# EAGLE design switch (EAGLE 7.6.0)

## Sheet 1 of 2
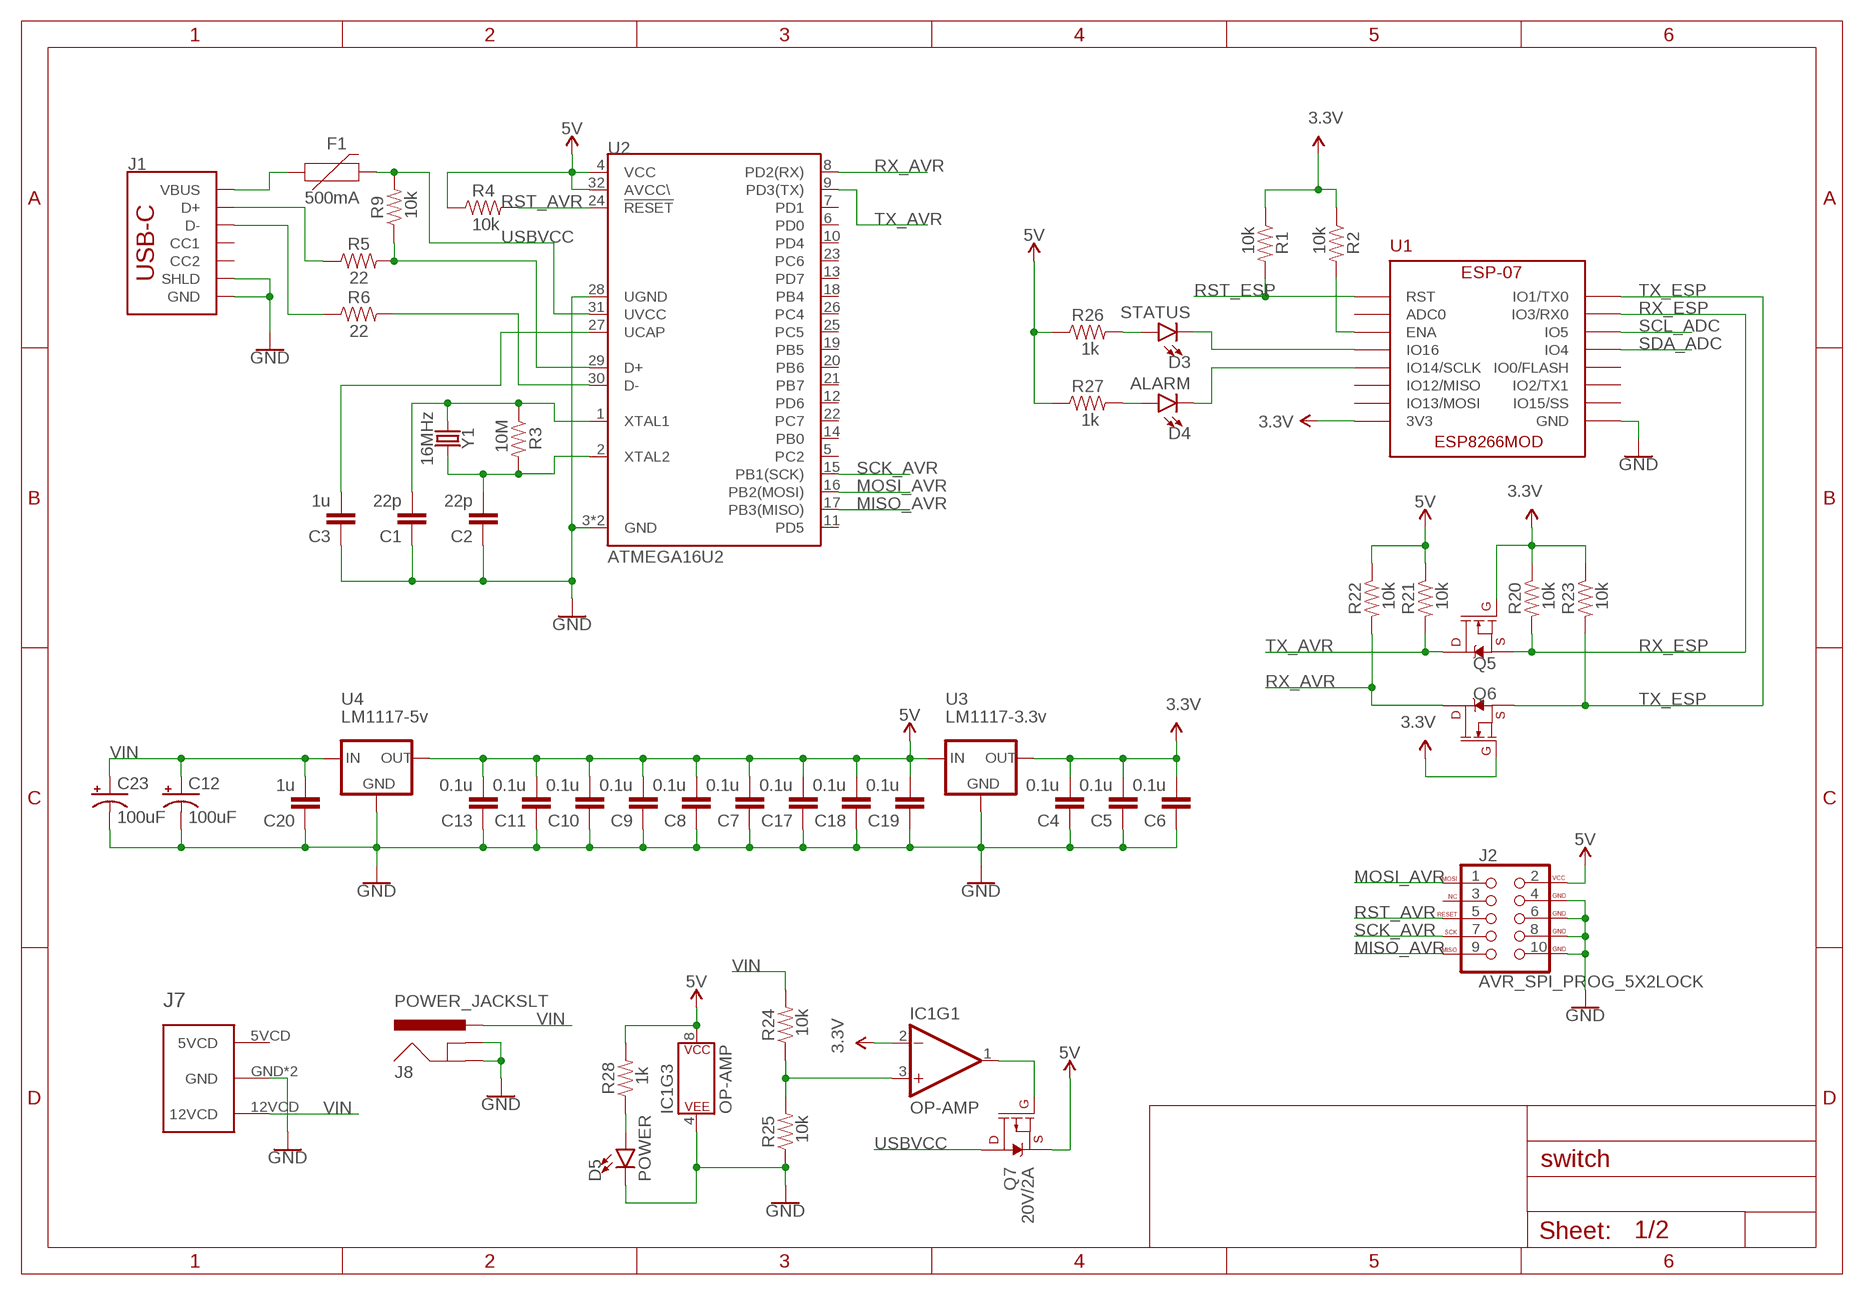
[diagram p0: schematic, sheet 1]

### Parts
C1  22p  CAP-0805  [0805]
C2  22p  CAP-0805  [0805]
C3  1u  CAP-0805  [0805]
C4  0.1u  CAP-0805  [0805]
C5  0.1u  CAP-0805  [0805]
C6  0.1u  CAP-0805  [0805]
C7  0.1u  CAP-0805  [0805]
C8  0.1u  CAP-0805  [0805]
C9  0.1u  CAP-0805  [0805]
C10  0.1u  CAP-0805  [0805]
C11  0.1u  CAP-0805  [0805]
C12  100uF  100UF-POLAR-25V-20%(ELEC)  [PANASONIC_D]
C13  0.1u  CAP-0805  [0805]
C17  0.1u  CAP-0805  [0805]
C18  0.1u  CAP-0805  [0805]
C19  0.1u  CAP-0805  [0805]
C20  1u  CAP-0805  [0805]
C23  100uF  100UF-POLAR-25V-20%(ELEC)  [PANASONIC_D]
D3  STATUS  LED-YELLOW0603  [LED-0603]
D4  ALARM  LED-YELLOW0603  [LED-0603]
D5  POWER  LED-YELLOW0603  [LED-0603]
F1  500mA  PPTC_16V_2.5A  [1812]
IC1  OP-AMP  OPAMP-DUALU  [SO08]
J1  USB_C_2-LAYER_PADS  [USB-C-16P-2LAYER-PADS]
J2  AVR_SPI_PROG_5X2LOCK  [2X5-SHROUDED_LOCK]
J7  MOLEX-CPU-POWER  [MOLEX-5.08-4PIN]
J8  POWER_JACKSLT  [POWER_JACK_SLOT]
Q5  220mA/50V/3.5Ω  MOSFET-NCH-BSS138  [SOT23-3]
Q6  220mA/50V/3.5Ω  MOSFET-NCH-BSS138  [SOT23-3]
Q7  20V/2A  MOSFET_PCH-DMG2305UX-7  [SOT23-3]
R1  10k  RESISTOR0805  [0805]
R2  10k  RESISTOR0805  [0805]
R3  10M  RESISTOR0805  [0805]
R4  10k  RESISTOR0805  [0805]
R5  22  RESISTOR0805  [0805]
R6  22  RESISTOR0805  [0805]
R9  10k  RESISTOR0805  [0805]
R20  10k  RESISTOR0805  [0805]
R21  10k  RESISTOR0805  [0805]
R22  10k  RESISTOR0805  [0805]
R23  10k  RESISTOR0805  [0805]
R24  10k  RESISTOR0805  [0805]
R25  10k  RESISTOR0805  [0805]
R26  1k  RESISTOR0805  [0805]
R27  1k  RESISTOR0805  [0805]
R28  1k  RESISTOR0805  [0805]
U1  ESP-07  [ESP-07]
U2  ATMEGA16U2  [QFN32]
U3  LM1117-3.3v  V_REG_LD1117VXXLD1117-SMD  [SOT223]
U4  LM1117-5v  V_REG_LD1117VXXLD1117-SMD  [SOT223]
Y1  16MHz  CRYSTAL-16MHZSMD-5X3.2  [CRYSTAL-SMD-5X3.2-4PAD]

### Nets
3.3V: C4.2 C5.2 C6.2 IC1.2(-IN) Q5.1(G) Q6.1(G) R1.1 R2.1 R20.1 R23.1 U1.3V3 U3.2(OUT)
5V: C7.2 C8.2 C9.2 C10.2 C11.2 C13.2 C17.2 C18.2 C19.2 IC1.8(P$V+) J2.2(VCC) Q7.2(S) R4.1 R21.1 R22.1 R26.1 R27.1 R28.2 U2.4(VCC) U2.32(AVCC\) U3.3(IN) U4.2(OUT)
GND: C1.1 C2.1 C3.1 C4.1 C5.1 C6.1 C7.1 C8.1 C9.1 C10.1 C11.1 C12.- C13.1 C17.1 C18.1 C19.1 C20.1 C23.- D5.C IC1.4(P$V-) J1.GND J1.GND2(GND) J1.SHLD1(SHLD) J1.SHLD2(SHLD) J1.SHLD3(SHLD) J1.SHLD4(SHLD) J2.4(GND) J2.6(GND) J2.8(GND) J2.10(GND) J7.GND J7.GND2(GND) J8.GND@1(GNDBREAK) J8.GND@2(GND) R25.1 U1.GND U2.3(GND) U2.28(UGND) U2.EP(GND) U3.1(GND) U4.1(GND)
MISO_AVR: J2.9(MISO) U2.17(PB3(MISO))
MOSI_AVR: J2.1(MOSI) U2.16(PB2(MOSI))
N$1: C1.2 R3.1 U2.1(XTAL1) Y1.1
N$2: C2.2 R3.2 U2.2(XTAL2) Y1.3
N$3: C3.2 U2.27(UCAP)
N$6: R6.2 U2.30(D-)
N$7: R5.2 R9.1 U2.29(D+)
N$8: J1.A6(D+) J1.B6(D+) R5.1
N$9: J1.A7(D-) J1.B7(D-) R6.1
N$10: F1.1 J1.VBUS1(VBUS) J1.VBUS2(VBUS)
N$14: R2.2 U1.ENA
N$28: IC1.1(OUT) Q7.1(G)
N$29: IC1.3(+IN) R24.1 R25.2
N$30: D3.C U1.I016(IO16)
N$31: D4.C U1.IO14(IO14/SCLK)
N$32: D3.A R26.2
N$33: D4.A R27.2
N$36: D5.A R28.1
RST_AVR: J2.5(RESET) R4.2 U2.24(!RESET)
RST_ESP: R1.2 U1.RST
RX_AVR: Q6.3(D) R22.2 U2.8(PD2(RX))
RX_ESP: Q5.2(S) R20.2 U1.RX0(IO3/RX0)
SCK_AVR: J2.7(SCK) U2.15(PB1(SCK))
SCL_ADC: U1.IO5
SDA_ADC: U1.IO4
TX_AVR: Q5.3(D) R21.2 U2.9(PD3(TX))
TX_ESP: Q6.2(S) R23.2 U1.TX0(IO1/TX0)
USBVCC: F1.2 Q7.3(D) R9.2 U2.31(UVCC)
VIN: C12.+ C20.2 C23.+ J7.12VCD J8.PWR R24.2 U4.3(IN)
Unconnected: IC1.5(+IN) IC1.6(-IN) IC1.7(OUT) J1.A5(CC1) J1.B5(CC2) J2.3(NC) J7.5VCD U1.ADC(ADC0) U1.IO0(IO0/FLASH) U1.IO2(IO2/TX1) U1.IO12(IO12/MISO) U1.IO13(IO13/MOSI) U1.IO15(IO15/SS) U2.5(PC2) U2.6(PD0) U2.7(PD1) U2.10(PD4) U2.11(PD5) U2.12(PD6) U2.13(PD7) U2.14(PB0) U2.18(PB4) U2.19(PB5) U2.20(PB6) U2.21(PB7) U2.22(PC7) U2.23(PC6) U2.25(PC5) U2.26(PC4)

## Sheet 2 of 2
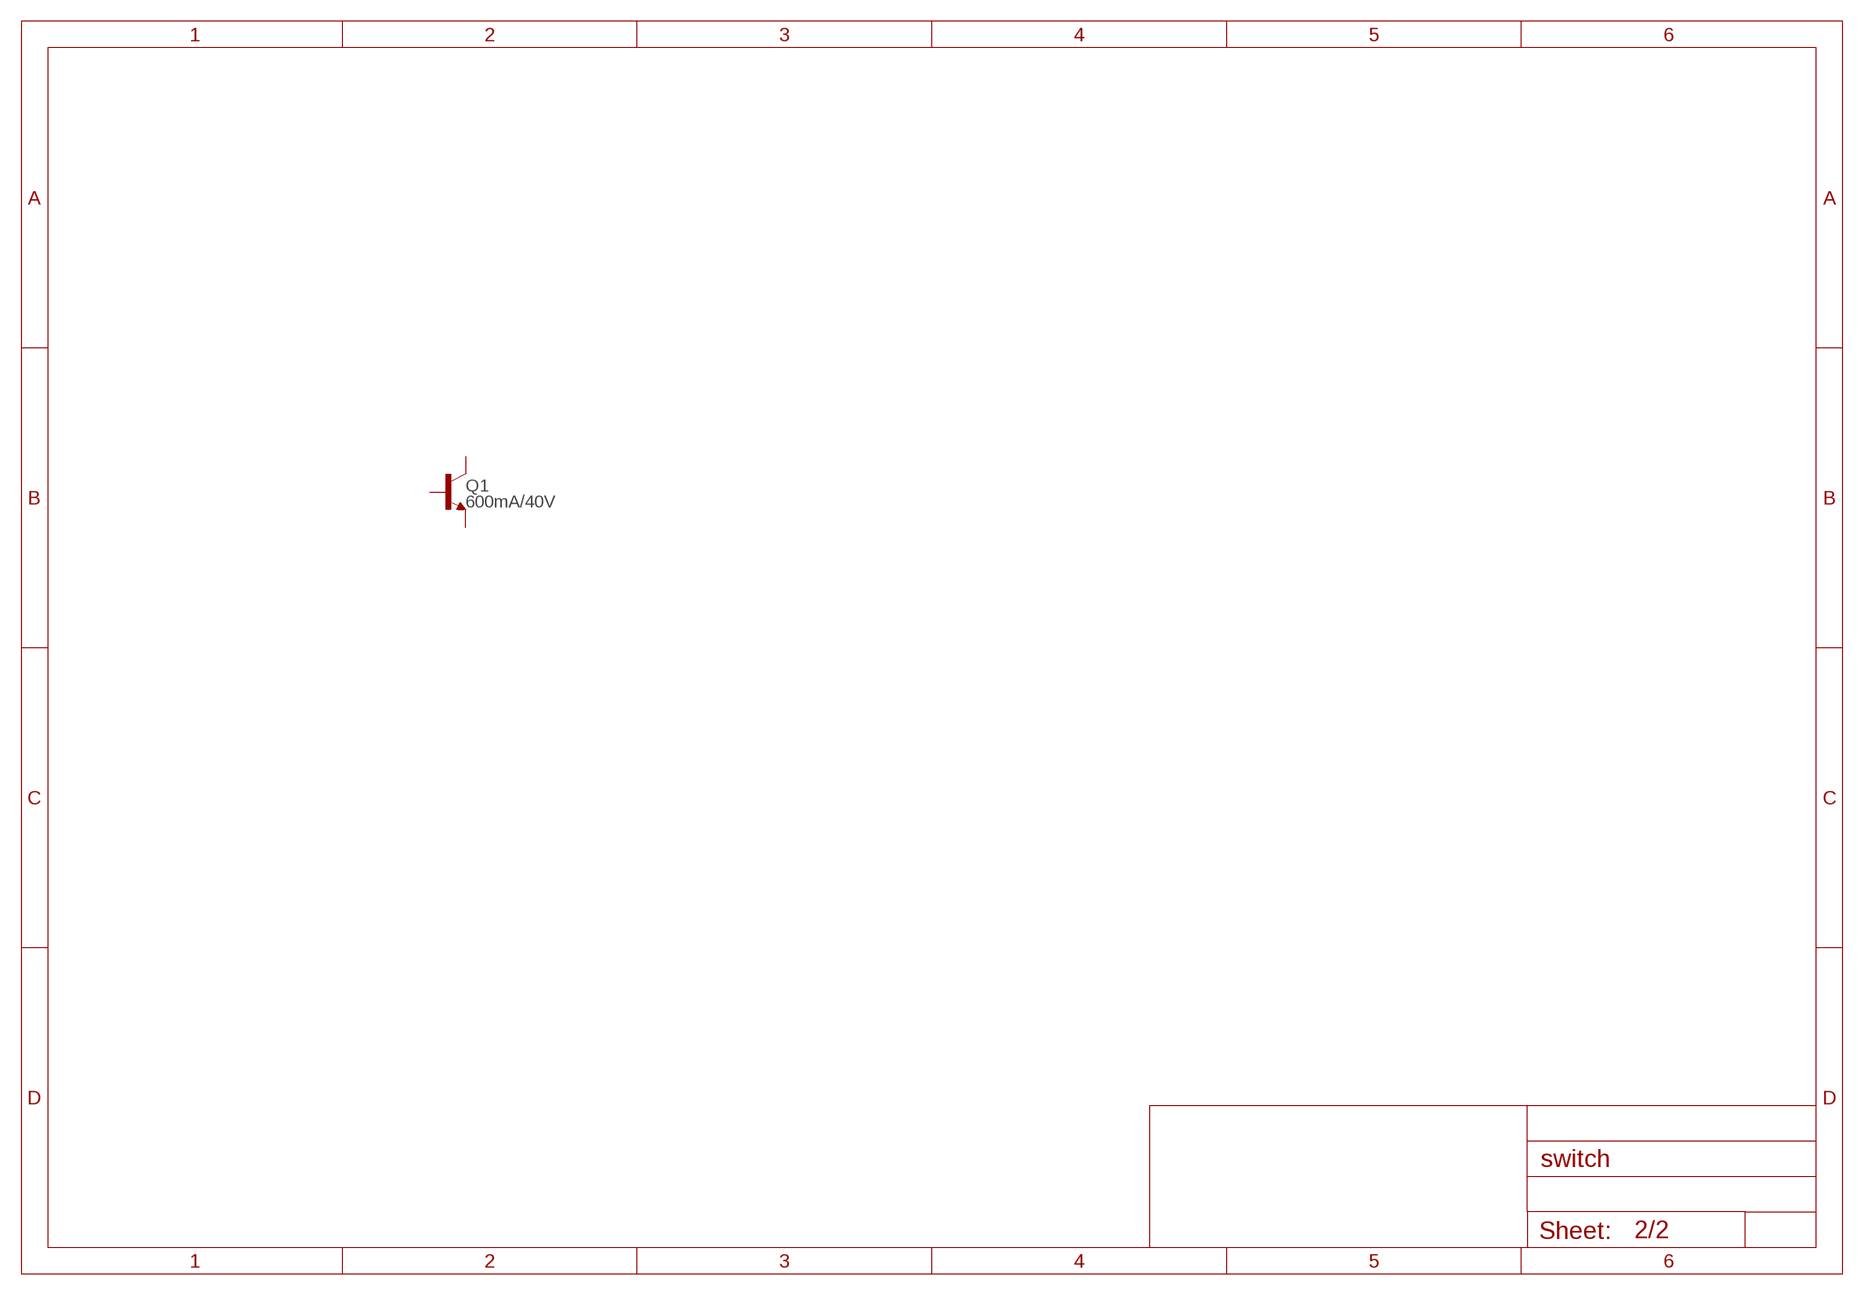
[diagram p1: schematic, sheet 2]

### Parts
Q1  600mA/40V  TRANS_NPN-MMBT2222AL  [SOT23-3]
Unconnected: Q1.1(B) Q1.2(E) Q1.3(C)

## Library data of the parts
C1-C11 C13 C17-C20 = SparkFun-Capacitors:CAP
C12 C23 = SparkFun-Capacitors:100UF-POLAR: 100µF polarized capacitors A capacitor is a passive two-terminal electrical component used to store electrical energy temporarily in an electric field.; PROD_ID: CAP-12547
D3-D5 = SparkFun-LED:LED-YELLOW: Yellow SMD LED Used in manufacturing several products at SparkFun. Packages: 0603 - SMD 0603 package[Product Link] <http://www.kingbrightusa.com/product.asp?catalog_name=LED&product_id=APT1608SYCK> 0603 -SMART - SMART SMD 0603 package (more efficient/more expensive) [Product Link] <http://www.osram-os.com/osram_os/en/products/product-catalog/led-light-emitting-diodes/smartled-0603/ly-l29k/index.jsp> LilyPad - SMD1206 package[Product Datasheet] <https://www.sparkfun.com/datasheets/DevTools/LilyPad/Q150YUS4.pdf> SparkFun Products: Blynk Board <https://www.sparkfun.com/products/13794> IOIO-OTG <https://www.sparkfun.com/products/13613> XBee Explorer Serial <https://www.sparkfun.com/products/13225>; PROD_ID: DIO-09003; VALUE: Yellow
F1 = SparkFun-Fuses:PPTC: Resettable Fuse PPTC Resettable Fuse. Really a sort of resistor with a polymeric positive temperature coefficient whose resistance increases dramatically with an increase in temperature. When heated by the power passing through the resistance rises causing the current to be limited, protecting the circuit. This is achieved by the transition of the polymer from a crystalline to an amorphous state where the conductive carbon separates breaking the conductive pathways found in the cool crystalline structure. When a PPTC cools back down it resumes conducting letting the circuit turn back on. SparkFun Products: SparkFun RedBoard - Programmed with Arduino <https://www.sparkfun.com/products/12757> Pro Micro - 5V/16MHz <https://www.sparkfun.com/products/12640> Arduino Pro 328 - 5V/16MHz <https://www.sparkfun.com/products/10915> MP3 Trigger <https://www.sparkfun.com/products/13720>; PROD_ID: RES-14390; VALUE: 16V/2.5A(5A TRIP)
IC1 = SparkFun-IC-Amplifiers:OPAMP-DUAL: Generic op-amp footprint This component is for the standard 358 pinning of a dual op-amp From the LM358 datasheet: Pin 1: Output A Pin 2: Inverting Input A Pin 3: Non-Inverting Input A Pin 4: Gnd Pin 5: Non-Inverting Input B Pin 6: Inverting Input B Pin 7: Output B Pin 8: V+; PROD_ID: NA-XXXXX
J1 = SparkFun-Connectors:USB_C: USB Type C 16Pin Connector Super Speed pins not available on the 16-pin purely SMD connector so this part is best for USB 2.0 implementations. D1 and D2 are tied together enabling D+/- no matter which way the cable is plugged into the connector. The two channel configuration pins (CC1/2) are exposed. These are normally connected to ground via 5.1k resistors but can be reconfigured for high current/high power applications. **4-LAYER BOARD WARNING!!** If designing 4-layer board, make sure to select the variant _4-LAYER-ISOLATED. The linked footprint (USB-C-16-4LAYER-ISOLATED) includes some very necessary cutout polygons in the inner layers (2 and 15). This prevents the PTH mounting shield legs on the USB connector from electrically connecting any other polygons on the inner layers (usually VCC and GND).; PROD_ID: CONN-14122
J2 = SparkFun-Connectors:AVR_SPI_PROG_5X2: AVR 10-pin ICSP Header This is the standard AVR In Circuit Serial Programming header. Minimal, but includes pin one indicator. Works with standard Olimex programmers. SparkFun Products: 2x5 AVR ICSP Male Header <https://www.sparkfun.com/products/778> - PTH 2x5 Pin Shrouded Header <https://www.sparkfun.com/products/8506> - PTH2; PROD_ID: CONN-08671; SF_ID: PRT-08506
J7 = Cominer-Connectors:MOLEX-CPU-POWER
J8 = SparkFun-Connectors:POWER_JACK: Power Jack Connector This is the standard 5.5mm barrel jack for power. The PTH is the most common, proven, reliable, footprint. The Slot footprint only works if the mill layer is transmitted to the PCB fab house so be warned. Here are the connectors we sell at SparkFun: DC Barrel Power Jack/Connector <https://www.sparkfun.com/products/119> (PRT-00119) DC Barrel Power Jack/Connector (SMD) <https://www.sparkfun.com/products/12748> (PRT-12748) DC Barrel Jack Adapter - Breadboard Compatible <https://www.sparkfun.com/products/10811> (PRT-10811) It is used on this SparkFun product (and many, many others): SparkFun RedBoard - Programmed with Arduino <https://www.sparkfun.com/products/12757> (DEV-12757) Also, if you need a mating power supply or connector, please check these out: Wall Adapter Power Supply - 9VDC 650mA <https://www.sparkfun.com/products/298> (TOL-00298) DC Barrel Jack Adapter - Male <https://www.sparkfun.com/products/10287> (PRT-10287); PROD_ID: PRT-00119
Q1 = SparkFun-DiscreteSemi:TRANS_NPN: NPN transistor Current controlled devices typically used to amplify current or used as a switch. BC547 - COM-08928 <http://www.sparkfun.com/products/8928> (TO-92 45V 100mA) (1.Collector 2.Base 3.Emitter) 2N3904 - COM-00521 <http://www.sparkfun.com/products/521> (TO-92 40V 200mA) (1.Emitter 2.Base 3.Collector) P2N2222A - COM-12852 <http://www.sparkfun.com/products/12852> (TO-92 40V 600mA) (1.Collector 2.Base 3.Emitter); PROD_ID: TRANS-08049
Q5 Q6 = SparkFun-DiscreteSemi:MOSFET-NCH: N-channel MOSFETs Voltage controlled devices that allow control of high current outputs. SparkFun Products: SparkFun OpenScale <https://www.sparkfun.com/products/13261> SparkFun Digital Sandbox <https://www.sparkfun.com/products/12651> SparkFun Monster Moto Shield <https://www.sparkfun.com/products/10182> SparkFun MOSFET Power Controller <https://www.sparkfun.com/products/11214>; PROD_ID: TRANS-00830
Q7 = SparkFun-DiscreteSemi:MOSFET_PCH: P-channel MOSFETs Voltage controlled devices that allow control of high current outputs. SparkFun Products: SparkFun ESP32 Thing <https://www.sparkfun.com/products/13907> SparkFun ESP8266 Thing <https://www.sparkfun.com/products/13231> SparkFun Pi Servo HAT V2 <https://www.sparkfun.com/products/15316> DMG2305UX-7 (20V/4.2A/SOT23-3); PROD_ID: TRAN-14388; VALUE: 20V/4.2A/52mΩ/1.4W
R1-R6 R9 R20-R28 = SparkFun-Resistors:RESISTOR: Generic Resistor Package
U1 = cominer library:ESP-07: Esp-07 Module Wifi ESP8266MOD by COMINER Team
U2 = Cominer-Microcontroller:ATMEGA16U2
U3 U4 = SparkFun-IC-Power:V_REG_LD1117VXX: LD1117VXX voltage regulator. We carry the 3.3V version (COM-00526) in TO-220 package.; PROD_ID: VREG-13917
Y1 = SparkFun-Clocks:CRYSTAL-16MHZ: 16MHz Crystal Digikey Example <http://www.digikey.com/product-search/en?keywords=535-9122-1-ND> Frequency: 16MHz Frequency Stability: ±50ppm Frequency Tolerance: ±20ppm Load Capacitance: 18pF SparkFun Products: Pro Micro -5V/16MHz <https://www.sparkfun.com/products/12640> SparkFun Serial Enabled LCD Kit <https://www.sparkfun.com/products/10097>; PROD_ID: XTAL-08218; SF_ID: COM-00094

## Board
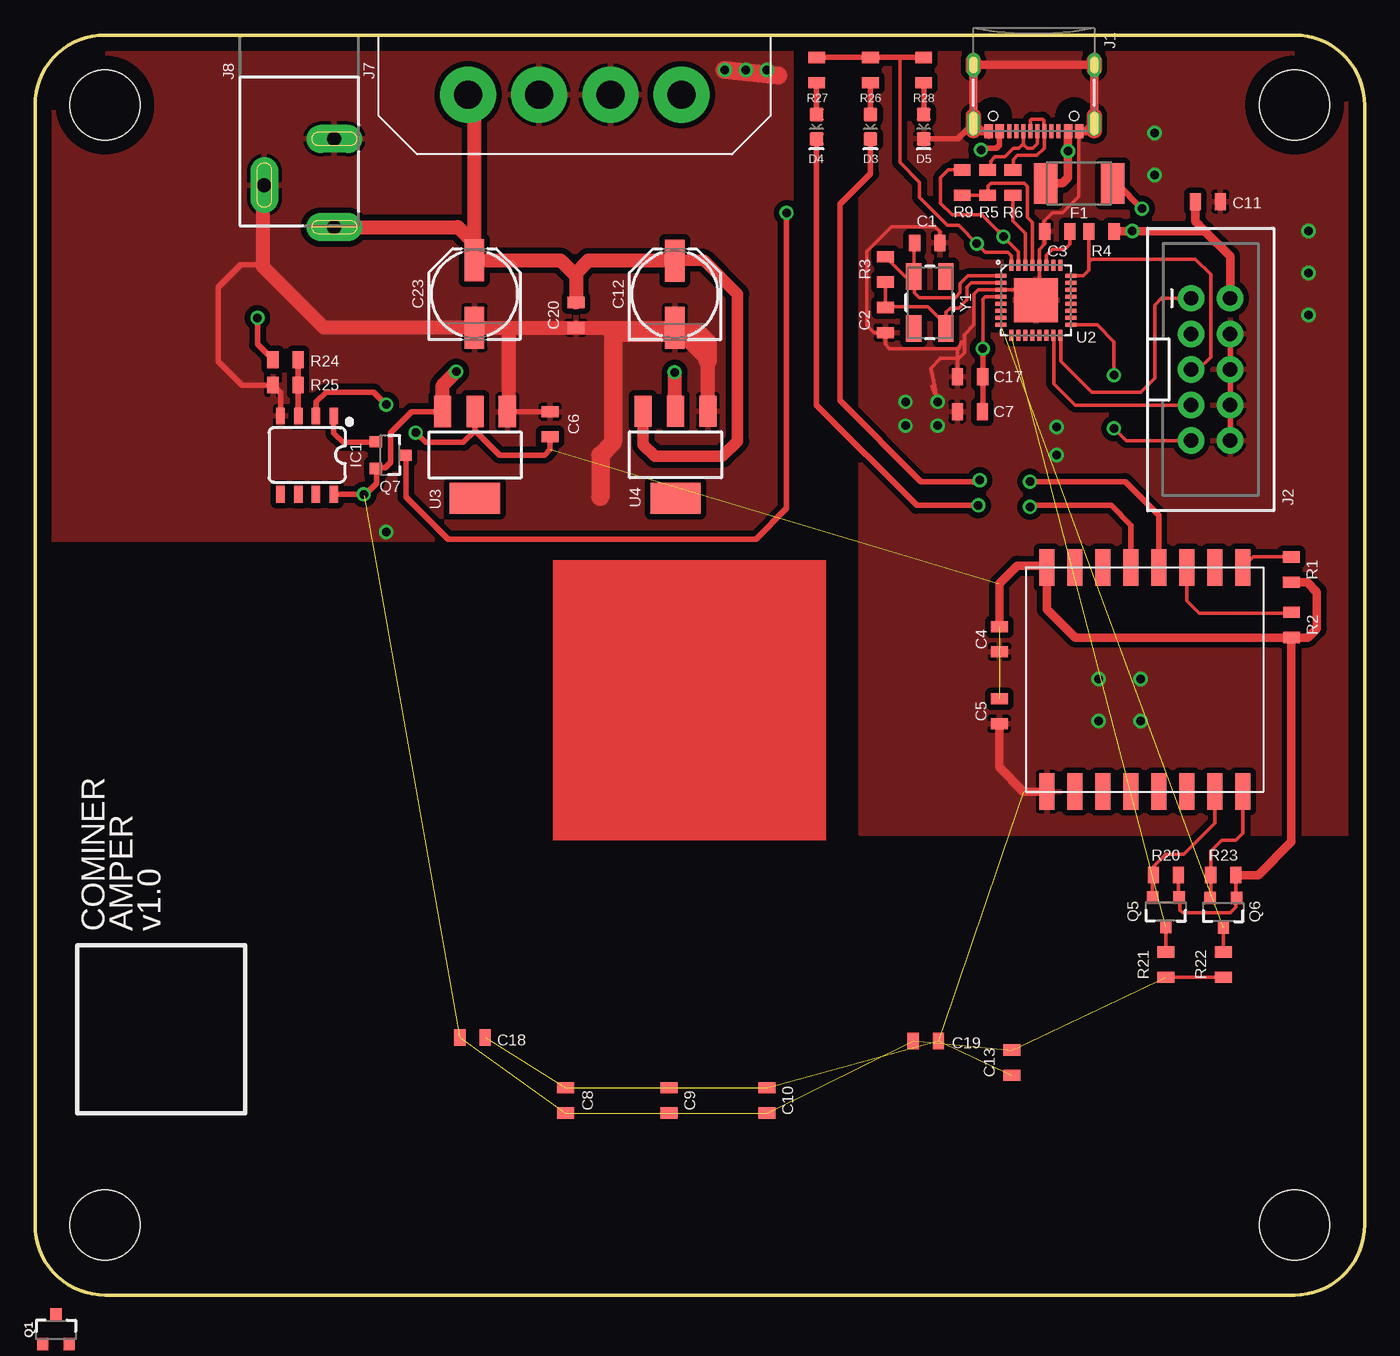
[diagram p2: board, top side]
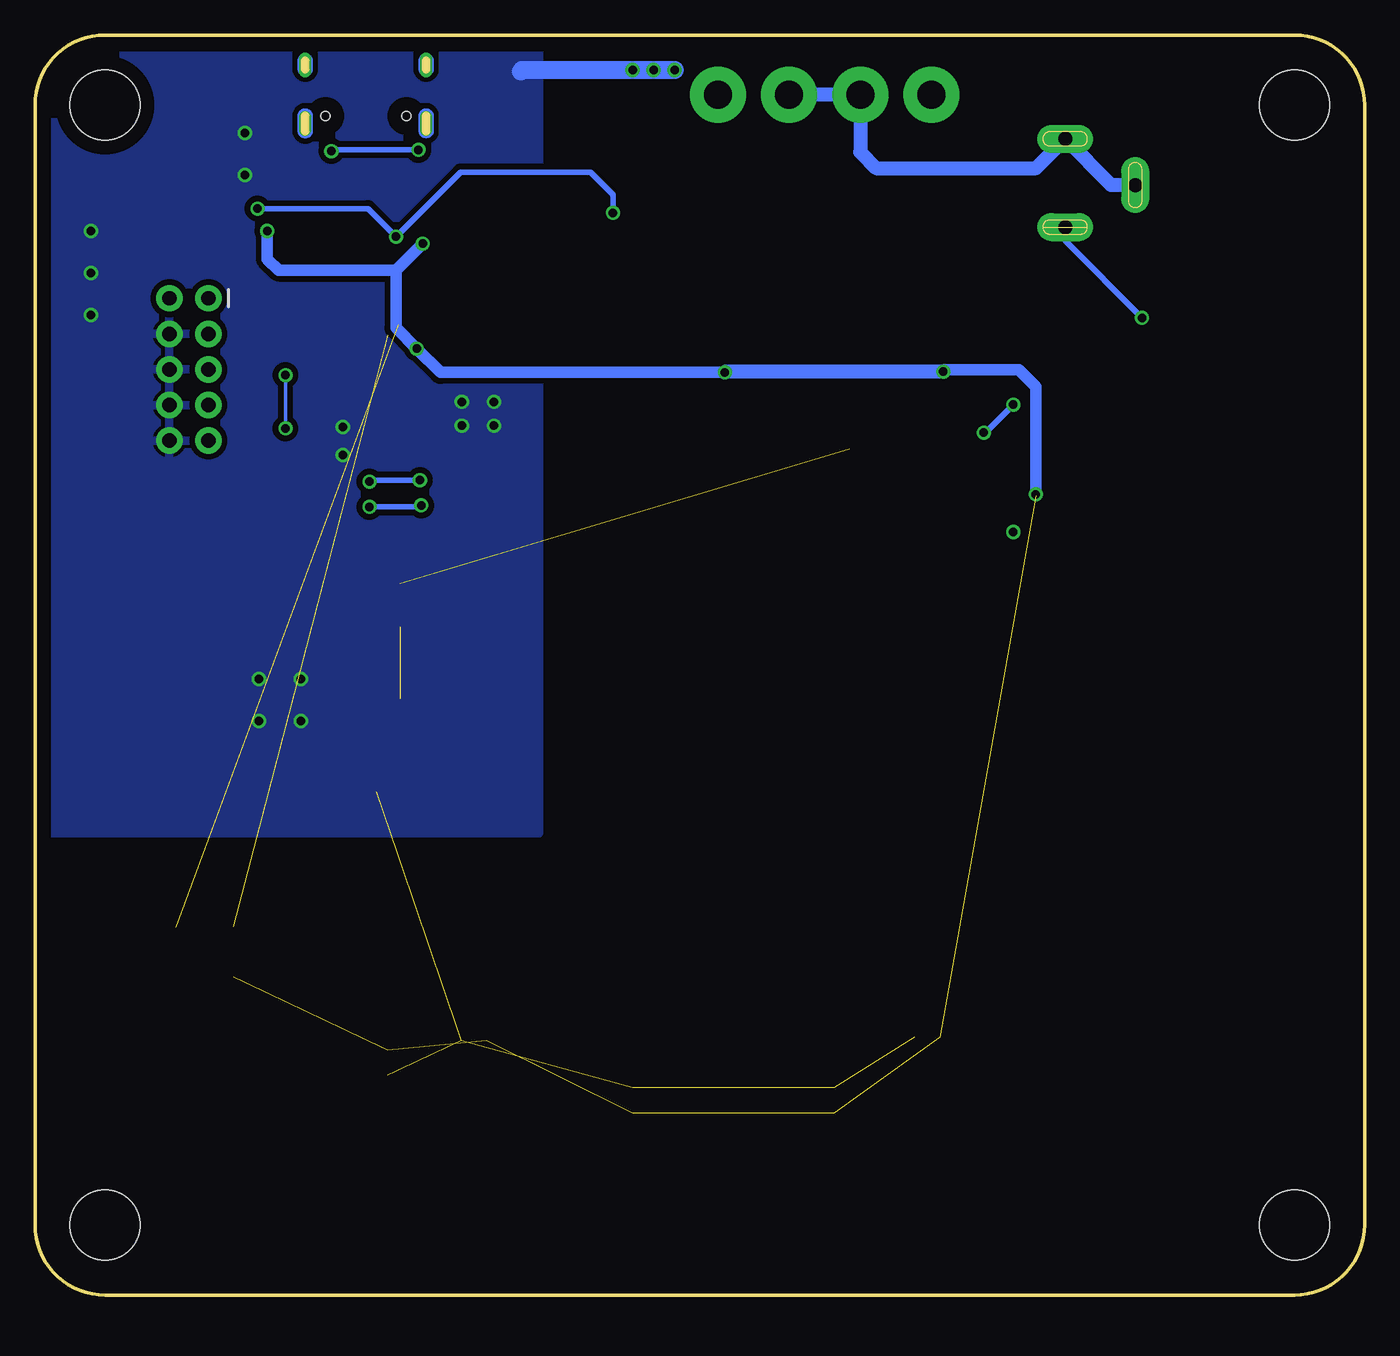
[diagram p3: board, bottom side, seen from below]

Size 95 x 90 mm. Coordinates in mm from the lower left corner, seen from the top.
Outline: 5,0 90,0 arc90 95,5 95,85 arc90 90,90 5,90 arc90 0,85 0,5 arc90 5,0
Copper layers (1*16): Top 0.035mm / dielectric 1.5mm / Bottom 0.035mm
Design rules "default": minimum track width 6mil, minimum drill 0.35mm, track to track 6mil, track to pad 6mil, pad to pad 6mil, via to via 6mil, smd to smd 6mil, copper to edge 40mil, drill to drill 6mil, minimum pad ring 10mil, minimum via ring 8mil, stop-mask expansion 4mil, vias tented up to drill 0mil, thermal gap 10mil
Holes 5 mm at 5,5 90,5 90,85 5,85

### Footprints (pad centres in the part's own frame; a part is rotated, then mirrored left to right if it is on the bottom)
0805 = smd 0.8 x 1.2: 1 -0.9,0; 2 0.9,0
PANASONIC_D = smd 3 x 1.4: + 2.4,0; - -2.4,0
LED-0603 = smd 1 x 1: A -0.877,0; C 0.877,0
1812 = smd 1.676 x 2.896: 1 -2.388,0; 2 2.388,0
SO08 = smd 0.6 x 1.2: 1 -1.905,-2.8; 2 -0.635,-2.8; 3 0.635,-2.8; 4 1.905,-2.8; 5 1.905,2.8; 6 0.635,2.8; 7 -0.635,2.8; 8 -1.905,2.8
USB-C-16P-2LAYER-PADS = smd 0.3 x 1: A5 -1.25,-0.34; A6 -0.25,-0.34; A7 0.25,-0.34; A8 1.25,-0.34; B5 1.75,-0.34; B6 0.75,-0.34; B7 -0.75,-0.34; B8 -1.75,-0.34 | smd 0.6 x 1: GND -3.225,-0.34; GND2 3.225,-0.34; VBUS1 -2.45,-0.34; VBUS2 2.45,-0.34 | drill 0.4 pad 0.6 long: SHLD1 -4.318,-0.915; SHLD2 4.318,-0.915; SHLD3 -4.318,-5.095; SHLD4 4.318,-5.095 | hole 0.65: -2.89,-1.445; 2.89,-1.445
2X5-SHROUDED_LOCK = drill 1.016 pad 1.88: 1 -1.397,5.08; 2 1.397,5.08; 3 -1.397,2.54; 4 1.397,2.54; 5 -1.397,0; 6 1.397,0; 7 -1.397,-2.54; 8 1.397,-2.54; 9 -1.397,-5.08; 10 1.397,-5.08
MOLEX-5.08-4PIN = drill 2 pad 4: 5VCD 7.62,0; 12VCD -7.62,0; GND -2.54,0; GND2 2.54,0
POWER_JACK_SLOT = drill 1 pad 2 long: GND@1 2.58,7.5; GND@2 7.58,10.8; PWR 2.58,13.8
SOT23-3 = smd 0.8 x 0.9: 1 -0.95,-1; 2 0.95,-1; 3 0,1.1
ESP-07 = smd 2.6 x 1.1: 3V3 0,1.5; ADC 0,13.5; ENA 0,11.5; GND 16,1.5; I016 0,9.5; IO0 16,7.5; IO2 16,5.5; IO4 16,9.5; IO5 16,11.5; IO12 0,5.5; IO13 0,3.5; IO14 0,7.5; IO15 16,3.5; RST 0,15.5; RX0 16,13.5; TX0 16,15.5
QFN32 = smd 0.285 x 0.8: 1 -1.04,-2.5; 2 -0.54,-2.5; 3 -0.04,-2.5; 4 0.46,-2.5; 5 0.96,-2.5; 6 1.46,-2.5; 7 1.96,-2.5; 8 2.46,-2.5; 17 2.46,2.5; 18 1.96,2.5; 19 1.46,2.5; 20 0.96,2.5; 21 0.46,2.5; 22 -0.04,2.5; 23 -0.54,2.5; 24 -1.04,2.5 | smd 0.8 x 0.285: 9 3.21,-1.75; 10 3.21,-1.25; 11 3.21,-0.75; 12 3.21,-0.25; 13 3.21,0.25; 14 3.21,0.75; 15 3.21,1.25; 16 3.21,1.75; 25 -1.79,1.75; 26 -1.79,1.25; 27 -1.79,0.75; 28 -1.79,0.25; 29 -1.79,-0.25; 30 -1.79,-0.75; 31 -1.79,-1.25; 32 -1.79,-1.75 | smd 3.15 x 3.15: EP 0.71,0
SOT223 = smd 1.219 x 2.235: 1 -2.311,-3.099; 2 0,-3.099; 3 2.311,-3.099 | smd 3.6 x 2.2: 4 0,3.099
CRYSTAL-SMD-5X3.2-4PAD = smd 1.9 x 1.1: 1 -1.85,-1.15; 2 1.85,-1.15; 3 1.85,1.15; 4 -1.85,1.15

### Placement (x,y rotation side)
C1  63.76,75.15 180 top
C2  60.76,69.64 90 top
C3  73.04,75.97 0 top
C4  68.92,46.84 90 top
C5  68.9,41.7 90 top
C6  36.8,62.2 270 top
C7  66.8,63.1 0 top
C8  37.9,13.9 270 top
C9  45.3,13.9 270 top
C10  52.3,13.9 270 top
C11  83.8,78.1 180 top
C12  45.72,71.48 90 top
C13  69.8,16.6 90 top
C17  66.82,65.59 0 top
C18  31.25,18.4 180 top
C19  63.65,18.15 180 top
C20  38.65,70 90 top
C23  31.4,71.5 90 top
D3  59.7,83.45 270 top
D4  55.85,83.45 270 top
D5  63.5,83.45 270 top
F1  74.6,79.4 0 top
IC1  19.45,59.99 180 top
J1  71.37,82.77 180 top
J2  84,66.11 0 top
J7  38.57,85.73 0 top
J8  23.97,90.08 180 top
Q1  1.5,-2.5 0 top
Q5  80.8,27.4 180 top
Q6  84.91,27.37 180 top
Q7  25.36,59.99 270 top
R1  89.76,51.82 90 top
R2  89.78,47.86 90 top
R3  60.76,73.26 270 top
R4  76.2,75.97 180 top
R5  68.07,79.46 270 top
R6  69.88,79.46 270 top
R9  66.25,79.46 90 top
R20  80.8,30 180 top
R21  80.8,23.6 90 top
R22  84.9,23.6 90 top
R23  84.9,30 180 top
R24  17.9,66.8 180 top
R25  17.9,65 0 top
R26  59.7,87.5 270 top
R27  55.85,87.5 270 top
R28  63.5,87.5 90 top
U1  70.8,51.96 270 top
U2  71.52,71.76 270 top
U3  31.44,60 180 top
U4  45.77,60.02 180 top
Y1  63.94,70.89 270 top

### Tracks (layer width: path | path; a pad name or v marks a point on that pad's centre or on a via)
3.3V  (via drill 0.6)  (2 unrouted)
  Top 0.254: R20.1 81.7,28.45 Q5.1 81.8,28.35 81.8,27.5 82,27.3 85.4,27.3 85.8,27.7 85.8,28.43 | R23.1 85.8,28.43 | 85.8,28.43 Q6.1
  Top 0.406: U3.2 31.44,61.74 | 31.44,61.74 30.6,60.9 27.9,60.9 v27.2,61.6 | v25.1,63.6 24.2,64.5 20.8,64.5 20.1,63.8 20.1,62.8 IC1.2 | C6.2 36.8,60.4 36.4,60 33.18,60 31.44,61.74
  Top 0.61: C4.2 68.92,50.82 70.2,52.1 72.16,52.1 U1.3V3 72.3,49 74.34,46.96 R2.1 | R2.1 90.96,46.96 91.6,47.6 91.6,50.2 90.9,50.9 89.78,50.9 R1.1 | R2.1 89.78,32.38 87.4,30 R23.1
  Bottom 0.406: v27.2,61.6 27.1,61.6 v25.1,63.6
5V  (via drill 0.6)  (7 unrouted)
  Top 0.254: R21.1 R22.1 | U2.4 67.9,71.3 67.72,71.12 v67.72,67.6 | U2.32 69.77,74.23 69.5,74.5 67.9,74.5 67.35,75.05 66,76.4 65.2,76.4 63.2,78.4 63.2,79.5 61.8,80.9 61.8,88.3 61.7,88.4
  Top 0.406: R27.1 R26.1 61.7,88.4 R28.2 | IC1.8 v23.49,57.19 | U3.3 26.9,63.1 25.4,61.6 25.4,59.5 25,59.1 24.42,59.1 Q7.2 24.4,59 24.4,58 23.5,57.1 | R4.1 78.37,75.97 v78.4,76 | v67.3,75.1 67.35,75.05 | v67.72,67.6 C17.2 67.72,63.12 C7.2
  Top 0.61: J2.2 85.4,74.2 83.6,76 | 83.6,76 v78.4,76 77.13,76 R4.1 | C11.2 82.9,76.7 83.6,76
  Top 1.016: U3.3 29.13,64.98 v30.1,65.95 | v45.7,65.9 45.7,63.19 U4.2
  Bottom 0.813: v78.4,76 78.4,74 77.6,73.2 69.2,73.2 | 69.2,73.2 v67.3,75.1 | 69.2,73.2 69.2,69.08 v67.72,67.6 66.02,65.9 v45.7,65.9 | v23.49,57.19 23.49,64.89 24.7,66.1 29.95,66.1 arc-90 v30.1,65.95
  Bottom 1.016: v30.1,65.95 45.65,65.95 v45.7,65.9
GND  (via drill 0.6)  (6 unrouted)
  Top 0.254: J1.GND 74.59,78.5 73.4,77.3 72.7,77.3 72.1,76.7 72.1,76.01 C3.1 72.14,75.04 71.77,74.67 U2.28 71.77,71.3 U2.EP 70.77,71.8 U2.3 67.4,71.8 67.1,71.5 67.1,69.3 66.4,68.6 66.4,67.3 66,66.9 64.7,66.9 64,66.2 v64.5,63.8 64.1,64.9 | C1.1 64.65,75.95 64.3,76.3 61.2,76.3 59.45,74.55 59.45,69.25 59.95,68.75 C2.1 60.75,67.9 61.05,67.6 66,67.6 | C17.1 65.92,67.52 66,67.6 | 66,67.6 66.2,68.1
  Top 0.406: D5.C 65.94,82.57 J1.SHLD2 | IC1.4 17.55,64.45 R25.1 14.8,65 13.1,66.7 13.1,72 14.7,73.6 16.3,73.6 | U3.1 C6.1 | J2.4 J2.6 J2.8 J2.10
  Top 0.61: J1.GND2 67.63,83.11 J1.SHLD2 J1.SHLD4 J1.SHLD3 J1.SHLD1 75.11,83.11 J1.GND | U1.GND 70.64,35.96 68.9,37.7 C5.1
  Top 0.813: v25.1,54.5 25.1,54.6
  Top 1.016: C23.- C20.1 45.7,69.1 C12.- 48.08,66.72 U4.1 | C23.- 33.8,69.1 33.85,69.05 33.85,63.2 U3.1 | C23.- 20.65,69.1 16.3,73.45 16.3,73.6 16.3,79.19 J8.GND@2
  Top 1.27: 48.08,66.72 48.08,68.02 47.4,68.7 41.4,68.7 41.3,68.6 41.3,60.9 40.4,60 40.4,57 | 53.1,87.1 v49.3,87.5
  Bottom 1.016: J8.GND@2 18.09,79.28 J8.GND@1 23.47,80.5 34.9,80.5 36.03,81.63 J7.GND J7.GND2
  Bottom 1.27: v49.3,87.5 60.2,87.5 60.3,87.4
  other vias: 76,44 79,44 79,41 76,41 80,83 80,80 73,62 73,60 91,73 91,76 91,70 62.2,63.8 64.5,62.1 62.2,62.1 50.8,87.5 52.3,87.5
  pour Top (isolate 0.406): -1,54 54,54 54,91 -1,91
  pour Top (isolate 0.406): 59,91 59,33 96,33 96,91
  pour Bottom (isolate 0.406): 59,92 97,92 97,33 59,33
MISO_AVR  (via drill 0.6)
  Top 0.254: J2.9 77.97,61.03 v77.1,61.9 | v77.1,65.7 77.1,68.1 75.9,69.3 U2.17
  Bottom 0.254: v77.1,61.9 v77.1,65.7
MOSI_AVR
  Top 0.254: J2.1 80.49,71.19 80,70.7 80,65.5 79,64.5 75.5,64.5 73.3,66.7 73.3,68.52 U2.16
N$1
  Top 0.254: U2.1 66.65,72.8 66.1,72.25 66.1,71.6 65.75,71.25 63.2,71.25 62.85,71.6 62.85,72.68 Y1.1 | C1.2 62.79,75.08 Y1.1 | R3.1 62.18,72.74 Y1.1
N$2
  Top 0.254: U2.2 66.9,72.3 66.6,72 66.6,71.1 66,70.5 65.4,70.5 65.1,70.2 Y1.3 65.09,69.31 63.8,70.6 60.82,70.6 C2.2 R3.2
N$3
  Top 0.254: U2.27 72.27,74.27 72.7,74.7 73.6,74.7 73.94,75.04 C3.2
N$6
  Top 0.254: R6.2 69.88,76.72 70.77,75.83 U2.30
N$7
  Top 0.254: R9.1 R5.2 68.1,78.59 68.1,79.2 68.3,79.4 70.7,79.4 70.9,79.2 70.9,77 71.27,76.63 U2.29
N$8
  Top 0.254: 68,80.43 R5.1 68.3,80.49 68.3,81 68.6,81.3 69.3,81.3 69.9,81.9 70.3,81.9 70.62,82.22 J1.B6 70.62,82.18 70.9,81.9 71.3,81.9 71.62,82.22 J1.A6
N$9
  Top 0.254: J1.A7 71.12,83.92 71.2,84 72,84 72.1,83.9 72.1,83.13 J1.B7 72.12,81.92 71.6,81.4 70.2,81.4 69.9,81.1 69.9,80.38 R6.1
N$10  (via drill 0.6)
  Top 0.254: 73.8,83.13 J1.VBUS1
  Top 0.406: J1.VBUS2 68.92,82.12 68.7,81.9 67.7,81.9 v67.6,81.8
  Top 0.61: 72.21,79.8 F1.1 73.4,79.4 73.82,79.82 v73.82,81.7 J1.VBUS1
  Bottom 0.406: v67.6,81.8 73.72,81.8 v73.82,81.7
N$14
  Top 0.254: U1.ENA 82.3,49.6 83.2,48.7 89.72,48.7 R2.2
N$28
  Top 0.406: IC1.1 21.36,61.55 22,60.9 24.32,60.9 Q7.1
N$29
  Top 0.406: R24.1 R25.2 18.8,62.8 IC1.3
N$30  (via drill 0.6)
  Top 0.406: U1.I016 80.3,55.7 77.9,58.1 v71.1,58.1 | D3.C 59.7,80.1 57.5,77.9 57.5,63.9 63.3,58.1 67.4,58.1 v67.5,58.2
  Bottom 0.406: v67.5,58.2 71,58.2 v71.1,58.1
N$31  (via drill 0.6)
  Top 0.406: U1.IO14 78.3,55 76.9,56.4 71.2,56.4 v71.1,56.3 | D4.C 55.85,63.55 63,56.4 v67.4,56.4
  Bottom 0.406: v71.1,56.3 67.5,56.3 v67.4,56.4
N$32
  Top 0.406: R26.2 D3.A
N$33
  Top 0.406: R27.2 D4.A
N$36
  Top 0.406: R28.1 D5.A
RST_AVR
  Top 0.254: U2.24 74.9,72.8 75.3,73.2 75.3,73.8 | 75.3,73.8 R4.2 | J2.5 83.11,66.11 84,67 84,72.9 82.9,74 75.5,74 75.3,73.8
RST_ESP
  Top 0.254: R1.2 87.06,52.72 U1.RST
RX_AVR  (1 unrouted)
  Top 0.254: R22.2 Q6.3
RX_ESP
  Top 0.254: U1.RX0 84.3,33.7 82.1,31.5 80.8,31.5 79.9,30.6 R20.2 79.85,29.95 Q5.2
SCK_AVR
  Top 0.254: J2.7 74.33,63.57 72.8,65.1 72.8,68.52 U2.15
TX_AVR  (1 unrouted)
  Top 0.254: R21.2 Q5.3
TX_ESP
  Top 0.254: U1.TX0 86.3,33 85.8,32.5 84.8,32.5 84,31.7 R23.2 84,28.41 Q6.2
USBVCC  (via drill 0.6)
  Top 0.254: R9.2 65.26,80.36 64.7,79.8 64.7,78 65.55,77.15 67.65,77.15 68.9,75.9 | v69.2,75.6 70.27,74.53 U2.31
  Top 0.406: F1.2 77.3,79.4 v79.1,77.6 | v69.2,75.6 68.9,75.9 | v53.7,77.3 53.7,56.2 51.5,54 29.5,54 26.5,57 26.5,59.95 Q7.3
  Bottom 0.406: v79.1,77.6 71.2,77.6 v69.2,75.6 64.6,80.2 55.3,80.2 53.7,78.6 v53.7,77.3
VIN  (via drill 0.6)
  Top 0.406: v15.9,69.8 15.9,67.9 R24.2
  Top 0.813: U4.3 43.46,60.74 44.3,59.9 49.1,59.9 50.2,61 50.2,71.5 47.8,73.9 45.74,73.9 C12.+
  Top 1.016: C12.+ 39.53,73.88 38.65,73 38.65,72.8 | 38.65,72.8 C20.2 | 38.65,72.8 37.55,73.9 C23.+ 31.4,75.1 | 31.4,75.1 31.4,85.28 J7.12VCD | J8.PWR 30.22,76.28 31.4,75.1
  Bottom 0.406: J8.PWR 21.39,75.29 v15.9,69.8
(copper drawn outside any net)
  shapes: Top area x1

### Text on the board
tPlace: COMINER | AMPER | v1.0
tNames: U2
200bmp: MINER PUNK